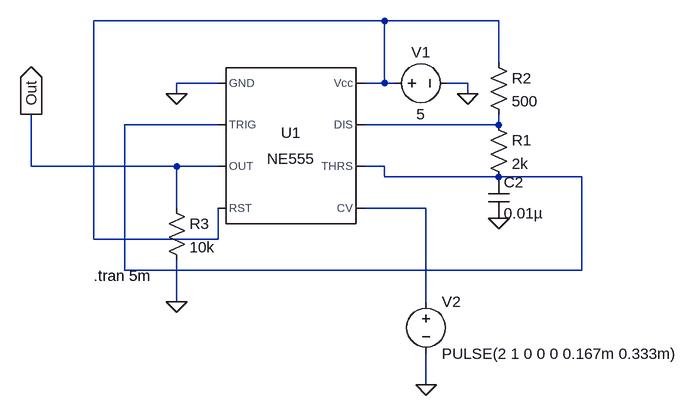
[diagram p0: schematic q2_2.asc]
q2_2.asc, the LTspice schematic file:
Version 4
SHEET 1 944 680
WIRE 368 -16 -80 -16
WIRE 544 -16 368 -16
WIRE 544 48 544 -16
WIRE 112 80 48 80
WIRE 368 80 368 -16
WIRE 368 80 336 80
WIRE 384 80 368 80
WIRE 496 80 464 80
WIRE 48 96 48 80
WIRE 496 96 496 80
WIRE 112 144 -32 144
WIRE 544 144 544 128
WIRE 544 144 336 144
WIRE -176 208 -176 128
WIRE 48 208 -176 208
WIRE 112 208 48 208
WIRE 368 208 336 208
WIRE 368 224 368 208
WIRE 544 224 368 224
WIRE 672 224 544 224
WIRE 48 272 48 208
WIRE 432 272 336 272
WIRE 544 288 544 272
WIRE -80 320 -80 -16
WIRE 112 320 112 272
WIRE 112 320 -80 320
WIRE -32 368 -32 144
WIRE 672 368 672 224
WIRE 672 368 -32 368
WIRE 48 416 48 352
WIRE 432 416 432 272
WIRE 432 544 432 496
FLAG 48 96 0
FLAG 496 96 0
FLAG 544 288 0
FLAG 432 544 0
FLAG -176 128 Out
IOPIN -176 128 Out
FLAG 48 416 0
SYMBOL Misc\\NE555 224 176 R0
SYMATTR InstName U1
SYMBOL voltage 368 80 R270
WINDOW 0 32 56 VTop 2
WINDOW 3 -32 56 VBottom 2
WINDOW 123 0 0 Left 0
WINDOW 39 0 0 Left 0
SYMATTR InstName V1
SYMATTR Value 5
SYMBOL res 528 32 R0
SYMATTR InstName R2
SYMATTR Value 500
SYMBOL res 528 128 R0
SYMATTR InstName R1
SYMATTR Value 2k
SYMBOL cap 528 224 R0
SYMATTR InstName C2
SYMATTR Value 0.01µ
SYMBOL voltage 432 400 R0
WINDOW 123 0 0 Left 0
WINDOW 39 0 0 Left 0
SYMATTR InstName V2
SYMATTR Value PULSE(2 1 0 0 0 0.167m 0.333m)
SYMBOL res 32 256 R0
SYMATTR InstName R3
SYMATTR Value 10k
TEXT -80 376 Left 2 !.tran 5m

The netlist it stands for:
* q2_2.asc
XU1 0 N002 Out N001 N004 N002 N003 N001 NE555  ; pins GND TRIG OUT RST CV THRS DIS Vcc
V1 N001 0 5
R2 N001 N003 500
R1 N003 N002 2k
C2 N002 0 0.01µ
V2 N004 0 PULSE(2 1 0 0 0 0.167m 0.333m)
R3 Out 0 10k
.tran 5m
.lib NE555.sub
.backanno
.end